# EasyEDA schematic STM32RCv2.json
TITLE: STM32RC Board with DAPLink; REV: 1.0; Date: 2021-12-26; Sheet: 1/1; Drawn By: XIVN1987
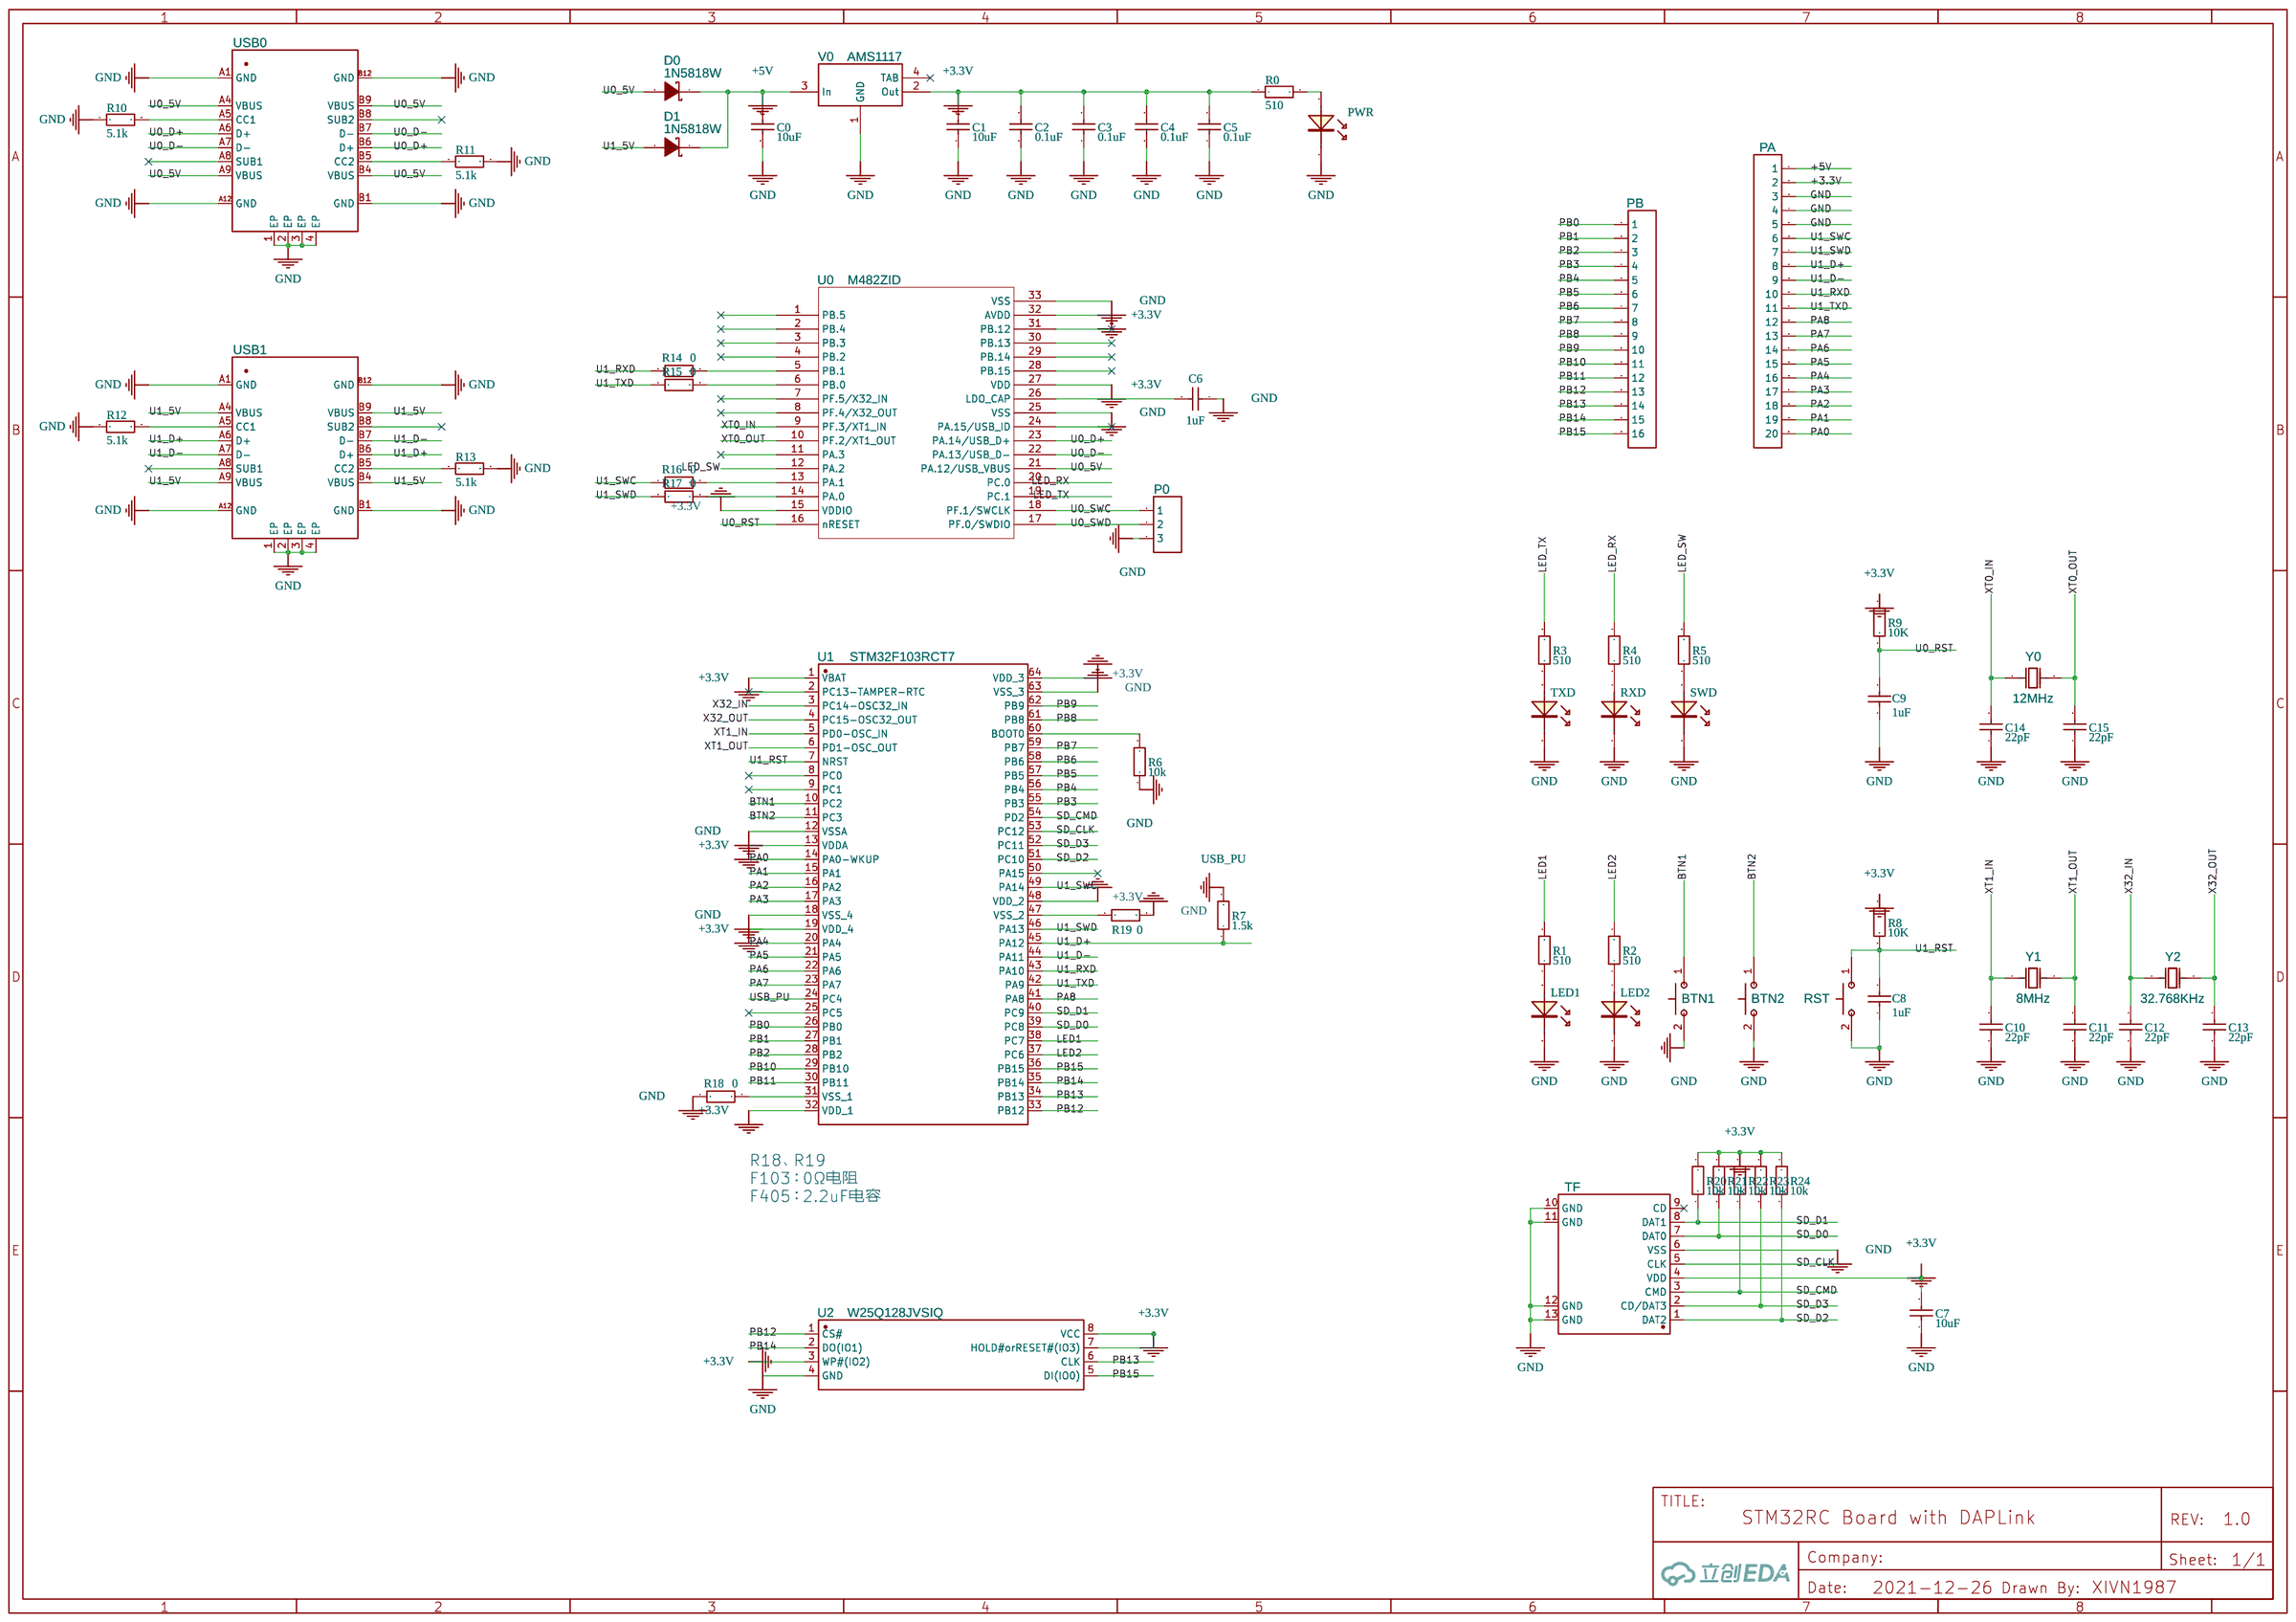
[diagram p0: schematic sheet]

## Parts
BTN1  1TS002B-2600-4301  [SW-SMD_L6.0-W3.5_1TS002B-2600-4301-CT]
BTN2  1TS002B-2600-4301  [SW-SMD_L6.0-W3.5_1TS002B-2600-4301-CT]
C0  10uF  [C0805]
C1  10uF  [C0805]
C2  0.1uF  [C0603]
C3  0.1uF  [C0603]
C4  0.1uF  [C0603]
C5  0.1uF  [C0603]
C6  1uF  [C0603]
C7  10uF  [C0805]
C8  1uF  [C0603]
C9  1uF  [C0603]
C10  22pF  [C0603]
C11  22pF  [C0603]
C12  22pF  [C0603]
C13  22pF  [C0603]
C14  22pF  [C0603]
C15  22pF  [C0603]
D0  1N5818W  [SOD-123FL_L2.8-W1.8-LS3.7-RD]
D1  1N5818W  [SOD-123FL_L2.8-W1.8-LS3.7-RD]
LED1  NO  [LED0805-FD]
LED2  NO  [LED0805-FD]
P0  HDR-M-2.54_1x3  [HDR-M-2.54_1X3]
PA  HDR-M-2.54_1x20  [HDR-M-2.54_1X20]
PB  HDR-M-2.54_1x16  [HDR-M-2.54_1X16]
PWR  NO  [LED0805-FD]
R0  510  [R0805]
R1  510  [R0805]
R2  510  [R0805]
R3  510  [R0805]
R4  510  [R0805]
R5  510  [R0805]
R6  10k  [R0603]
R7  1.5k  [R0603]
R8  10K  [R0603]
R9  10K  [R0603]
R10  5.1k  [R0603]
R11  5.1k  [R0603]
R12  5.1k  [R0603]
R13  5.1k  [R0603]
R14  0  [R0603]
R15  0  [R0603]
R16  0  [R0603]
R17  0  [R0603]
R18  0  [R0603]
R19  0  [R0603]
R20  10k  [R0603]
R21  10k  [R0603]
R22  10k  [R0603]
R23  10k  [R0603]
R24  10k  [R0603]
RST  1TS002B-2600-4301  [SW-SMD_L6.0-W3.5_1TS002B-2600-4301-CT]
RXD  NO  [LED0805-FD]
SWD  NO  [LED0805-FD]
TF  TF-01A_C2889258  [TF-SMD_TF-02]
TXD  NO  [LED0805-FD]
U0  M482ZID  [QFN-32_5X5X05P]
U1  STM32F103RCT7  [LQFP-64_L10.0-W10.0-P0.50-LS12.0-BL]
U2  W25Q128JVSIQ  [SOIC-8_L5.3-W5.3-P1.27-LS8.0-BL]
USB0  KH-TYPE-C-16P-T  [USB-C-SMD_KH-TYPE-C-16P]
USB1  KH-TYPE-C-16P-T  [USB-C-SMD_KH-TYPE-C-16P]
V0  AMS1117  [SOT-223-4_L6.5-W3.5-P2.30-LS7.0-BR]
Y0  12MHz  [OSC-SMD_L5.0-W3.2]
Y1  8MHz  [OSC-SMD_L5.0-W3.2]
Y2  32.768KHz  [OSC-SMD_L3.2-W1.5]

## Library data of the parts
BTN1 BTN2 RST = 1TS002B-2600-4301: Supplier: LCSC; Supplier Part: C318835; Manufacturer: HYP; Contributor: LCSC; JLCPCB Part Class: Extended Part
D0 D1 = 1N5818W: Supplier: LCSC; Supplier Part: C437955; Manufacturer: Shandong Jingdao Microelectronics; Contributor: LCSC; JLCPCB Part Class: Extended Part
P0 = HDR-M-2.54_1x3: Supplier Part: C180248; Supplier: LCSC; Contributor: LCEDA_Lib
PA = HDR-M-2.54_1x20: Supplier Part: C50981; Supplier: LCSC; Contributor: LCEDA_Lib
PB = HDR-M-2.54_1x16: Supplier Part: C50981; Supplier: LCSC; Contributor: LCEDA_Lib
TF = TF-01A_C2889258: Supplier: LCSC; Supplier Part: C2889258; Manufacturer: Yuandi(台湾元迪); Manufacturer Part: TF-01A; Contributor: LCSC
U0 = M482ZID: Contributor: XIVN1987
U1 = STM32F103RCT7: Supplier: LCSC; Supplier Part: C882165; Manufacturer: STMicroelectronics; Contributor: LCSC; JLCPCB Part Class: Extended Part
U2 = W25Q128JVSIQ: Supplier: LCSC; Supplier Part: C113767; Manufacturer: Winbond Elec; Contributor: LCSC; JLCPCB Part Class: Extended Part
USB0 USB1 = KH-TYPE-C-16P-T: Supplier: LCSC; Supplier Part: C709358; Manufacturer: Shenzhen Kinghelm Elec; Contributor: LCSC; JLCPCB Part Class: Extended Part
V0 = AMS1117-2.5: Supplier: LCSC; Manufacturer: AMS; Supplier Part: C12087; JLCPCB Part Class: Extended Part
Y0 Y1 = X503212MSB2GI: Supplier: LCSC; Manufacturer: YXC; Supplier Part: C112573; JLCPCB Part Class: Extended Part
Y2 = 7LC32768F12UC: Supplier: LCSC; Supplier Part: C252398; Manufacturer: SHENZHEN CRYSTAL TECH; Contributor: LCSC; JLCPCB Part Class: Extended Part

## Nets
+3.3V: C1.2 C2.2 C3.2 C4.2 C5.2 C7.2 PA.2 R0.1 R8.1 R9.1 R20.1 R21.1 R22.1 R23.1 R24.1 TF.4(VDD) U0.15(VDDIO) U0.27(VDD) U0.32(AVDD) U1.1(VBAT) U1.13(VDDA) U1.19(VDD_4) U1.32(VDD_1) U1.48(VDD_2) U1.64(VDD_3) U2.3(WP#(IO2)) U2.7(HOLD#orRESET#(IO3)) U2.8(VCC) V0.2(Out)
+5V: C0.2 D0.1(C) D1.1(C) PA.1 V0.3(In)
GND: BTN1.2(B) BTN2.2(B) C0.1 C1.1 C2.1 C3.1 C4.1 C5.1 C6.1 C7.1 C8.1 C9.1 C10.1 C11.1 C12.1 C13.1 C14.1 C15.1 LED1.2(K) LED2.2(K) P0.3 PA.3 PA.4 PA.5 PWR.2(K) R6.1 R10.1 R11.2 R12.1 R13.2 R18.1 R19.2 RST.2(B) RXD.2(K) SWD.2(K) TF.6(VSS) TF.10(GND) TF.11(GND) TF.12(GND) TF.13(GND) TXD.2(K) U0.25(VSS) U0.33(VSS) U1.12(VSSA) U1.18(VSS_4) U1.63(VSS_3) U2.4(GND) USB0.1(EP) USB0.2(EP) USB0.3(EP) USB0.4(EP) USB0.A1(GND) USB0.A12(GND) USB0.B1(GND) USB0.B12(GND) USB1.1(EP) USB1.2(EP) USB1.3(EP) USB1.4(EP) USB1.A1(GND) USB1.A12(GND) USB1.B1(GND) USB1.B12(GND) V0.1(GND)
BTN1: BTN1.1(A) U1.10(PC2)
BTN2: BTN2.1(A) U1.11(PC3)
LED1: R1.2 U1.38(PC7)
LED2: R2.2 U1.37(PC6)
LED_RX: R4.2 U0.20(PC.0)
LED_SW: R5.2 U0.12(PA.2)
LED_TX: R3.2 U0.19(PC.1)
PA0: PA.20 U1.14(PA0-WKUP)
PA1: PA.19 U1.15(PA1)
PA2: PA.18 U1.16(PA2)
PA3: PA.17 U1.17(PA3)
PA4: PA.16 U1.20(PA4)
PA5: PA.15 U1.21(PA5)
PA6: PA.14 U1.22(PA6)
PA7: PA.13 U1.23(PA7)
PA8: PA.12 U1.41(PA8)
PB0: PB.1 U1.26(PB0)
PB1: PB.2 U1.27(PB1)
PB2: PB.3 U1.28(PB2)
PB3: PB.4 U1.55(PB3)
PB4: PB.5 U1.56(PB4)
PB5: PB.6 U1.57(PB5)
PB6: PB.7 U1.58(PB6)
PB7: PB.8 U1.59(PB7)
PB8: PB.9 U1.61(PB8)
PB9: PB.10 U1.62(PB9)
PB10: PB.11 U1.29(PB10)
PB11: PB.12 U1.30(PB11)
PB12: PB.13 U1.33(PB12) U2.1(CS#)
PB13: PB.14 U1.34(PB13) U2.6(CLK)
PB14: PB.15 U1.35(PB14) U2.2(DO(IO1))
PB15: PB.16 U1.36(PB15) U2.5(DI(IO0))
SD_CLK: TF.5(CLK) U1.53(PC12)
SD_CMD: R22.2 TF.3(CMD) U1.54(PD2)
SD_D0: R21.2 TF.7(DAT0) U1.39(PC8)
SD_D1: R20.2 TF.8(DAT1) U1.40(PC9)
SD_D2: R24.2 TF.1(DAT2) U1.51(PC10)
SD_D3: R23.2 TF.2(CD/DAT3) U1.52(PC11)
U0_5V: D0.2(A) U0.21(PA.12/USB_VBUS) USB0.A4(VBUS) USB0.A9(VBUS) USB0.B4(VBUS) USB0.B9(VBUS)
U0_D+: U0.23(PA.14/USB_D+) USB0.A6(D+) USB0.B6(D+)
U0_D-: U0.22(PA.13/USB_D-) USB0.A7(D-) USB0.B7(D-)
U0_RST: C9.2 R9.2 U0.16(nRESET)
U0_SWC: P0.1 U0.18(PF.1/SWCLK)
U0_SWD: P0.2 U0.17(PF.0/SWDIO)
U1_5V: D1.2(A) USB1.A4(VBUS) USB1.A9(VBUS) USB1.B4(VBUS) USB1.B9(VBUS)
U1_D+: PA.8 R7.1 U1.45(PA12) USB1.A6(D+) USB1.B6(D+)
U1_D-: PA.9 U1.44(PA11) USB1.A7(D-) USB1.B7(D-)
U1_RST: C8.2 R8.2 RST.1(A) U1.7(NRST)
U1_RXD: PA.10 R14.1 U1.43(PA10)
U1_SWC: PA.6 R16.1 U1.49(PA14)
U1_SWD: PA.7 R17.1 U1.46(PA13)
U1_TXD: PA.11 R15.1 U1.42(PA9)
USB_PU: R7.2 U1.24(PC4)
X32_IN: C12.2 U1.3(PC14-OSC32_IN) Y2.1(OSC1)
X32_OUT: C13.2 U1.4(PC15-OSC32_OUT) Y2.2(OSC2)
XT0_IN: C14.2 U0.9(PF.3/XT1_IN) Y0.1(OSC1)
XT0_OUT: C15.2 U0.10(PF.2/XT1_OUT) Y0.2(OSC2)
XT1_IN: C10.2 U1.5(PD0-OSC_IN) Y1.1(OSC1)
XT1_OUT: C11.2 U1.6(PD1-OSC_OUT) Y1.2(OSC2)
Net-(C6-2): C6.2 U0.26(LDO_CAP)
Net-(LED1-1): LED1.1(A) R1.1
Net-(LED2-1): LED2.1(A) R2.1
Net-(PWR-1): PWR.1(A) R0.2
Net-(R3-1): R3.1 TXD.1(A)
Net-(R4-1): R4.1 RXD.1(A)
Net-(R5-1): R5.1 SWD.1(A)
Net-(R6-2): R6.2 U1.60(BOOT0)
Net-(R10-2): R10.2 USB0.A5(CC1)
Net-(R11-1): R11.1 USB0.B5(CC2)
Net-(R12-2): R12.2 USB1.A5(CC1)
Net-(R13-1): R13.1 USB1.B5(CC2)
Net-(R14-2): R14.2 U0.5(PB.1)
Net-(R15-2): R15.2 U0.6(PB.0)
Net-(R16-2): R16.2 U0.13(PA.1)
Net-(R17-2): R17.2 U0.14(PA.0)
Net-(R18-2): R18.2 U1.31(VSS_1)
Net-(R19-1): R19.1 U1.47(VSS_2)

Not connected (* = marked no-connect by the designer): TF 9(CD)*; U0 1(PB.5) 2(PB.4) 3(PB.3) 4(PB.2) 7(PF.5/X32_IN) 8(PF.4/X32_OUT) 11(PA.3) 24(PA.15/USB_ID) 28(PB.15) 29(PB.14) 30(PB.13) 31(PB.12); U1 2(PC13-TAMPER-RTC) 8(PC0) 9(PC1) 25(PC5) 50(PA15); USB0 A8(SUB1) B8(SUB2); USB1 A8(SUB1) B8(SUB2); V0 4(TAB)*

## Notes on the sheet
- R18、R19
  F103：0Ω电阻
  F405：2.2uF电容
